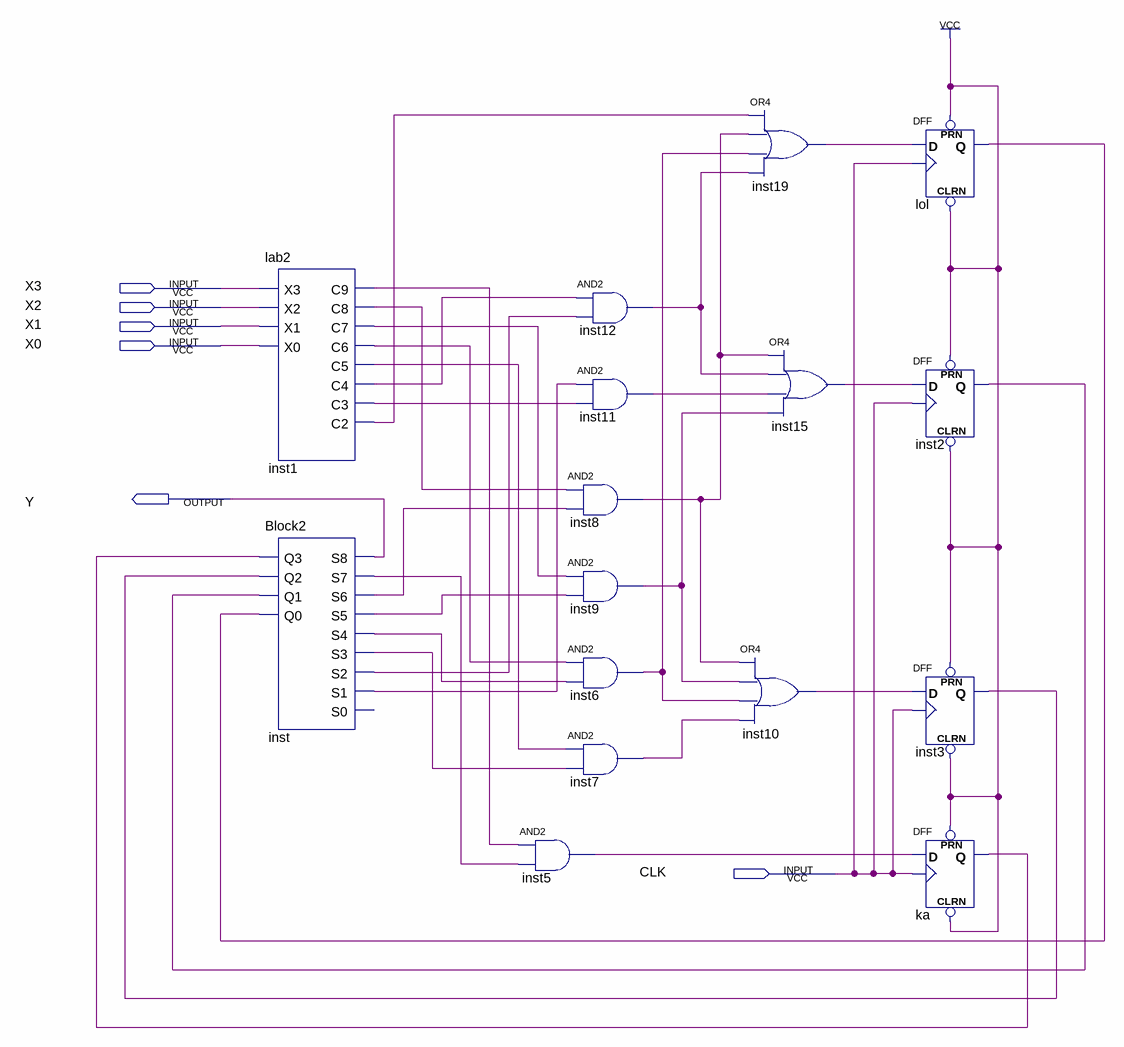
[diagram p0: schematic sheet]
// Quartus schematic Block3.bdf as structural Verilog: 16 symbols, 6 pins
module Block3 (
  input  X3,
  input  X2,
  input  X1,
  input  X0,
  input  CLK,
  output Y
);

  wire inst1_c2, inst1_c3, inst1_c4, inst1_c5, inst1_c6, inst1_c7, inst1_c8, inst1_c9, inst2_q, inst3_q,
       inst5_out, inst6_out, inst7_out, inst8_out, inst9_out, inst10_out, inst11_out, inst12_out, inst15_out,
       inst19_out, inst_s1, inst_s2, inst_s3, inst_s4, inst_s5, inst_s6, inst_s7, ka_q, lol_q;

  lab2 inst1 (
    .X3(X3), .X2(X2), .X1(X1), .X0(X0), .C9(inst1_c9), .C8(inst1_c8), .C7(inst1_c7), .C6(inst1_c6),
    .C5(inst1_c5), .C4(inst1_c4), .C3(inst1_c3), .C2(inst1_c2));
  Block2 inst (
    .Q3(ka_q), .Q2(inst3_q), .Q1(inst2_q), .Q0(lol_q), .S8(Y), .S7(inst_s7), .S6(inst_s6), .S5(inst_s5),
    .S4(inst_s4), .S3(inst_s3), .S2(inst_s2), .S1(inst_s1));  // open: S0
  and inst5 (inst5_out, inst1_c9, inst_s7);
  and inst12 (inst12_out, inst1_c4, inst_s2);
  and inst11 (inst11_out, inst_s1, inst1_c3);
  and inst8 (inst8_out, inst1_c8, inst_s6);
  and inst9 (inst9_out, inst1_c7, inst_s5);
  and inst6 (inst6_out, inst1_c6, inst_s4);
  and inst7 (inst7_out, inst1_c5, inst_s3);
  or inst19 (inst19_out, inst1_c2, inst8_out, inst6_out, inst12_out);
  or inst10 (inst10_out, inst8_out, inst9_out, inst6_out, inst7_out);
  or inst15 (inst15_out, inst8_out, inst12_out, inst11_out, inst9_out);
  DFF lol (.CLRN(1'b1), .CLK(CLK), .D(inst19_out), .PRN(1'b1), .Q(lol_q));
  DFF inst2 (.CLRN(1'b1), .CLK(CLK), .D(inst15_out), .PRN(1'b1), .Q(inst2_q));
  DFF inst3 (.CLRN(1'b1), .CLK(CLK), .D(inst10_out), .PRN(1'b1), .Q(inst3_q));
  DFF ka (.CLRN(1'b1), .CLK(CLK), .D(inst5_out), .PRN(1'b1), .Q(ka_q));
endmodule
